# Altium project EtchaSound.PrjPcb
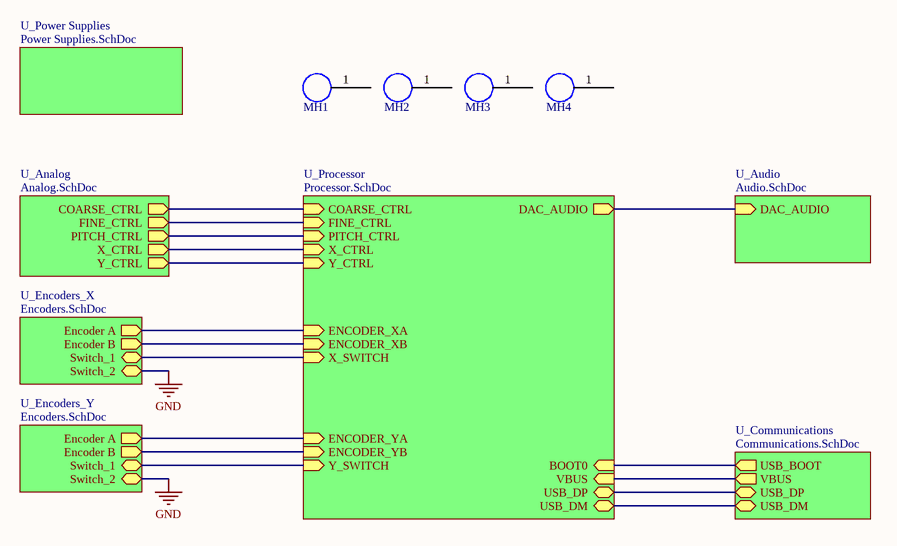
[diagram p0: Top Level.SchDoc]
7 sheets, 150 parts. Net scope: hierarchical (ports join the sheet entries above them; power ports are global).
Board file: PCB1.PcbDoc
Sheets:
  Top Level.SchDoc
    U_Encoders_X = Encoders.SchDoc
    U_Encoders_Y = Encoders.SchDoc
    U_Analog = Analog.SchDoc
    U_Communications = Communications.SchDoc
    U_Processor = Processor.SchDoc
    U_Power Supplies = Power Supplies.SchDoc
    U_Audio = Audio.SchDoc

## Sheet Top Level.SchDoc
size A

### Parts
MH1  MH  [M2_P]  (value not drawn)
MH2  MH  [M2_P]  (value not drawn)
MH3  MH  [M2_P]  (value not drawn)
MH4  MH  [M2_P]  (value not drawn)

### Sub-sheets
U_Analog = Analog.SchDoc: COARSE_CTRL (out), FINE_CTRL (out), Y_CTRL (out), X_CTRL (out), PITCH_CTRL (out)
U_Audio = Audio.SchDoc: DAC_AUDIO (in)
U_Communications = Communications.SchDoc: VBUS (out), USB_DM (bidir), USB_DP (bidir), USB_BOOT (out)
U_Encoders_X = Encoders.SchDoc: Encoder B (out), Encoder A (out), Switch_1, Switch_2
U_Encoders_Y = Encoders.SchDoc: Encoder B (out), Encoder A (out), Switch_2, Switch_1
U_Power Supplies = Power Supplies.SchDoc: no entries
U_Processor = Processor.SchDoc: Y_SWITCH (in), X_SWITCH (in), ENCODER_XA (in), ENCODER_XB (in), ENCODER_YA (in), ENCODER_YB (in), DAC_AUDIO (out), PITCH_CTRL (in), FINE_CTRL (in), COARSE_CTRL (in), X_CTRL (in), Y_CTRL (in), USB_DM (bidir), VBUS (in), USB_DP (bidir), BOOT0 (in)

### Nets
GND: sheet U_Encoders_X/Switch_2, sheet U_Encoders_Y/Switch_2
NetC5X_2: sheet U_Encoders_X/Encoder B, sheet U_Processor/ENCODER_XB
NetC5Y_2: sheet U_Encoders_Y/Encoder B, sheet U_Processor/ENCODER_YB
NetC6X_2: sheet U_Encoders_X/Encoder A, sheet U_Processor/ENCODER_XA
NetC6Y_2: sheet U_Encoders_Y/Encoder A, sheet U_Processor/ENCODER_YA
NetC40_2: sheet U_Analog/COARSE_CTRL, sheet U_Processor/COARSE_CTRL
NetC42_2: sheet U_Analog/FINE_CTRL, sheet U_Processor/FINE_CTRL
NetR3_2: sheet U_Processor/DAC_AUDIO, sheet U_Audio/DAC_AUDIO
NetR13_2: sheet U_Analog/X_CTRL, sheet U_Processor/X_CTRL
NetR14_2: sheet U_Analog/Y_CTRL, sheet U_Processor/Y_CTRL
NetR15_2: sheet U_Analog/PITCH_CTRL, sheet U_Processor/PITCH_CTRL
NetR41_2: sheet U_Communications/USB_DM, sheet U_Processor/USB_DM
NetR42_2: sheet U_Communications/USB_DP, sheet U_Processor/USB_DP
NetR44_2: sheet U_Communications/VBUS, sheet U_Processor/VBUS
NetR46_1: sheet U_Communications/USB_BOOT, sheet U_Processor/BOOT0
NetU2_EX_1: sheet U_Encoders_X/Switch_1, sheet U_Processor/X_SWITCH
NetU2_EY_1: sheet U_Encoders_Y/Switch_1, sheet U_Processor/Y_SWITCH

Not connected (* = marked no-connect by the designer): MH1 1; MH2 1; MH3 1; MH4 1

### Library data of the parts
MH1-MH4 = MH: Mounting Hole

## Sheet Encoders.SchDoc
size A
Used 2 times, as channels U_Encoders_X, U_Encoders_Y. Parts and nets are listed once, with the designators drawn on the sheet.
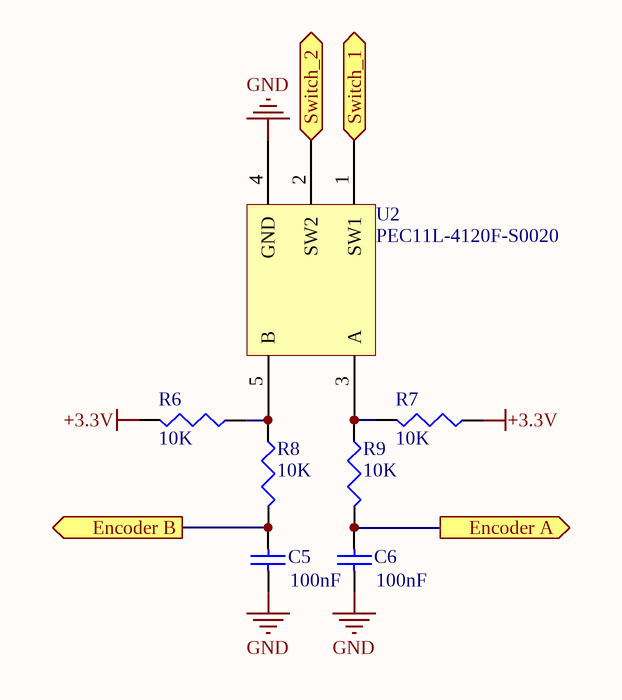
[diagram p1: Encoders.SchDoc]

### Parts
C5  value 100nF  [RES_0603]  (hidden comment: 06035G104ZAT2A)
C6  value 100nF  [RES_0603]  (hidden comment: 06035G104ZAT2A)
R6  value 10K  [RES_0805]  (hidden comment: RR1220P-103-D)
R7  value 10K  [RES_0805]  (hidden comment: RR1220P-103-D)
R8  value 10K  [RES_0805]  (hidden comment: RR1220P-103-D)
R9  value 10K  [RES_0805]  (hidden comment: RR1220P-103-D)
U2  PEC11L-4120F-S0020  [ENC5]

### Ports
Encoder A (out), Encoder B (out), Switch_1, Switch_2

### Nets
+3.3V: R6.2 R7.1
GND: C5.1 C6.1 U2.4(GND)
Encoder A: C6.2 R9.2 ; port Encoder A
Encoder B: C5.2 R8.2 ; port Encoder B
Switch_1: U2.1(SW1) ; port Switch_1
Switch_2: U2.2(SW2) ; port Switch_2
NetR6_1: R6.1 R8.1 U2.5(B)
NetR7_2: R7.2 R9.1 U2.3(A)

### Channels
U_Encoders_X: designators C5=C5X C6=C6X R6=R6X R7=R7X R8=R8X R9=R9X U2=U2_EX; ports Encoder A=NetC6X_2 Encoder B=NetC5X_2 Switch_1=NetU2_EX_1 Switch_2=GND
U_Encoders_Y: designators C5=C5Y C6=C6Y R6=R6Y R7=R7Y R8=R8Y R9=R9Y U2=U2_EY; ports Encoder A=NetC6Y_2 Encoder B=NetC5Y_2 Switch_1=NetU2_EY_1 Switch_2=GND

### Library data of the parts
C5 C6 = Cap: Capacitor; Manufacturer: AVX Corporation; Manufacturer Part Number: 06035G104ZAT2A; Supplier 1: Digi-Key; Supplier Part Number 1: 478-3724-1-ND
R6-R9 = Res3: Resistor; Manufacturer: Susumu; Manufacturer Part Number: RR1220P-103-D; Supplier 1: Digi-Key; Supplier Part Number 1: RR12P10.0KDCT-ND
U2 = PEC11-4215F-S24: Rotary Encoder with Switch; Manufacturer: Bourns Inc.; Manufacturer Part Number: PEC11L-4120F-S0020; Supplier 1: Digi-Key; Supplier Part Number 1: PEC11L-4120F-S0020-ND

## Sheet Analog.SchDoc
size B
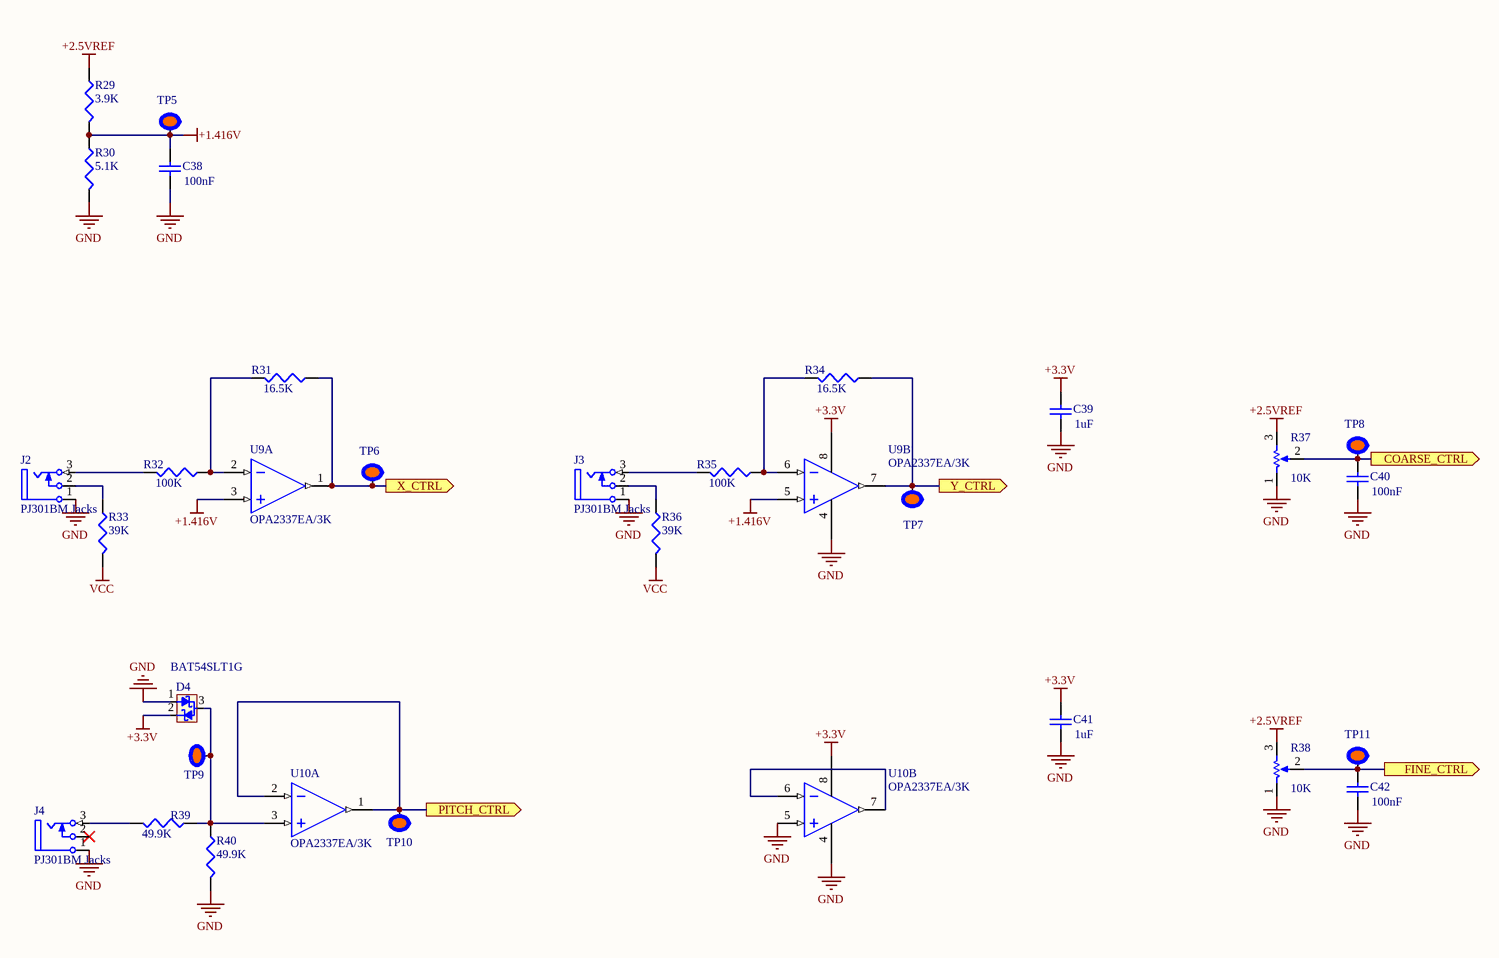
[diagram p2: Analog.SchDoc]

### Parts
C38  value 100nF  [RES_0603]  (hidden comment: 06035G104ZAT2A)
C39  value 1uF  [RES_0603]  (hidden comment: CL10A105KA8NNNC)
C40  value 100nF  [RES_0603]  (hidden comment: 06035G104ZAT2A)
C41  value 1uF  [RES_0603]  (hidden comment: CL10A105KA8NNNC)
C42  value 100nF  [RES_0603]  (hidden comment: 06035G104ZAT2A)
D4  BAT54SLT1G  [SOT23]
J2  PJ301BM Jacks  [WQP-PJ301M-12_JACK]
J3  PJ301BM Jacks  [WQP-PJ301M-12_JACK]
J4  PJ301BM Jacks  [WQP-PJ301M-12_JACK]
R29  value 3.9K  [RES_0603]  (hidden comment: ERA-3AEB392V)
R30  value 5.1K  [RES_0603]  (hidden comment: ERA-3AEB512V)
R31  value 16.5K  [RES_0603]  (hidden comment: ERA-3AEB1652V)
R32  value 100K  [RES_0603]  (hidden comment: RR0816P-104-D)
R33  value 39K  [RES_0603]  (hidden comment: ERA-3AEB393V)
R34  value 16.5K  [RES_0603]  (hidden comment: ERA-3AEB1652V)
R35  value 100K  [RES_0603]  (hidden comment: RR0816P-104-D)
R36  value 39K  [RES_0603]  (hidden comment: ERA-3AEB393V)
R37  value 10K  [P0915NEC15BR100K]  (hidden comment: P0915N-FC15BR10K)
R38  value 10K  [P0915NEC15BR100K]  (hidden comment: P0915N-FC15BR10K)
R39  value 49.9K  [RES_0603]  (hidden comment: ERA-3AEB4992V)
R40  value 49.9K  [RES_0603]  (hidden comment: ERA-3AEB4992V)
TP5  loop test point  [Test Point Mt Hole]  (value not drawn)
TP6  loop test point  [Test Point Mt Hole]  (value not drawn)
TP7  loop test point  [Test Point Mt Hole]  (value not drawn)
TP8  loop test point  [Test Point Mt Hole]  (value not drawn)
TP9  loop test point  [Test Point Mt Hole]  (value not drawn)
TP10  loop test point  [Test Point Mt Hole]  (value not drawn)
TP11  loop test point  [Test Point Mt Hole]  (value not drawn)
U9  OPA2337EA/3K  [SOT-23-8]  (parts A,B of 2)
U10  OPA2337EA/3K  [SOT-23-8]  (parts A,B of 2)

### Ports
COARSE_CTRL (out), FINE_CTRL (out), PITCH_CTRL (out), X_CTRL (out), Y_CTRL (out)

### Nets
+1.416V: C38.2 R29.2 R30.1 TP5.1 U9.3(IN_A+) U9.5(IN_B+)
+2.5VREF: R29.1 R37.3 R38.3
+3.3V: C39.2 C41.2 D4.2 U9.8 U10.8
GND: C38.1 C39.1 C40.1 C41.1 C42.1 D4.1 J2.1(S) J3.1(S) J4.1(S) R30.2 R37.1 R38.1 R40.2 U9.4 U10.4 U10.5(IN_B+)
VCC: R33.2 R36.2
NetC40_2: C40.2 R37.2 TP8.1 ; port COARSE_CTRL
NetC42_2: C42.2 R38.2 TP11.1 ; port FINE_CTRL
NetD4_3: D4.3 R39.1 R40.1 TP9.1 U10.3(IN_A+)
NetJ2_2: J2.2(TN) R33.1
NetJ2_3: J2.3(T) R32.2
NetJ3_2: J3.2(TN) R36.1
NetJ3_3: J3.3(T) R35.2
NetJ4_3: J4.3(T) R39.2
NetR13_2: R31.1 TP6.1 U9.1(OUT_A) ; port X_CTRL
NetR14_2: R34.1 TP7.1 U9.7(OUT_B) ; port Y_CTRL
NetR15_2: TP10.1 U10.1(OUT_A) U10.2(IN_A-) ; port PITCH_CTRL
NetR31_2: R31.2 R32.1 U9.2(IN_A-)
NetR34_2: R34.2 R35.1 U9.6(IN_B-)
NetU10_6: U10.6(IN_B-) U10.7(OUT_B)

Not connected (* = marked no-connect by the designer): J4 2(TN)*

### Library data of the parts
C38 C40 C42 = Cap: Capacitor; Manufacturer: AVX Corporation; Manufacturer Part Number: 06035G104ZAT2A; Supplier 1: Digi-Key; Supplier Part Number 1: 478-3724-1-ND
C39 C41 = Cap: Capacitor; Manufacturer: Samsung Electro-Mechanics; Manufacturer Part Number: CL10A105KA8NNNC; Supplier 1: Digi-Key; Supplier Part Number 1: 1276-1102-1-ND
D4 = SCHOTTKY DIODE ARRAY: DIODE ARRAY SCHOTTKY; Manufacturer: ON Semiconductor; Supplier 1: Digi-Key; Supplier Part Number 1: BAT54SLT1GOSCT-ND; Manufacturer Part Number: BAT54SLT1G
J2-J4 = Phonejack2 TN: Jack Socket, 1/4" [6.5mm], Thru-Hole, Vertical, 2-Conductor with Tip closed; Manufacturer: Thonkiconn; Manufacturer Part Number: PJ301BM Jacks
R29-R31 R34 R39 R40 = Res3: Resistor; Manufacturer: Panasonic; Supplier 1: Digi-Key
  R29: Manufacturer Part Number: ERA-3AEB392V; Supplier Part Number 1: P3.9KDBCT-ND
  R30: Manufacturer Part Number: ERA-3AEB512V; Supplier Part Number 1: P5.1KDBCT-ND
  R31 R34: Manufacturer Part Number: ERA-3AEB1652V; Supplier Part Number 1: P16.5KDBCT-ND
  R39 R40: Manufacturer Part Number: ERA-3AEB4992V; Supplier Part Number 1: P49.9KDBTR-ND
R32 R35 = Res3: Resistor; Manufacturer: Susumu; Manufacturer Part Number: RR0816P-104-D; Supplier 1: Digi-Key; Supplier Part Number 1: RR08P100KDCT-ND
R33 R36 = Res3: Manufacturer: Panasonic Electronic Components; Manufacturer Part Number: ERA-3AEB393V; Supplier 1: Digi-Key; Supplier Part Number 1: P39KDBCT-ND
R37 R38 = RPot: Potentiometer; Manufacturer: TT Electronics/BI; Manufacturer Part Number: P0915N-FC15BR10K; Supplier 1: Digi-Key; Supplier 1 Part Number: 987-1649-ND
TP5-TP11 = 402046: Test Point Loop Miniature Keysone; Manufacturer: Keystone Electronics; Manufacturer Part Number: 5003; Supplier 1: Digi-Key; Supplier Part Number 1: 36-5003-ND
U9 U10 = OPA2137E/2K5: Low Cost FET-Input Operational Amplifier, 4.5 to 36 V, -40 to 85 degC, 8-pin SOP (DGK8), Green (RoHS & no Sb/Br); Manufacturer: Texas Instruments; Manufacturer Part Number: OPA2337EA/3K; Supplier 1: Digi-Key; Supplier Part Number 1: 296-26252-1-ND

## Sheet Communications.SchDoc
size A
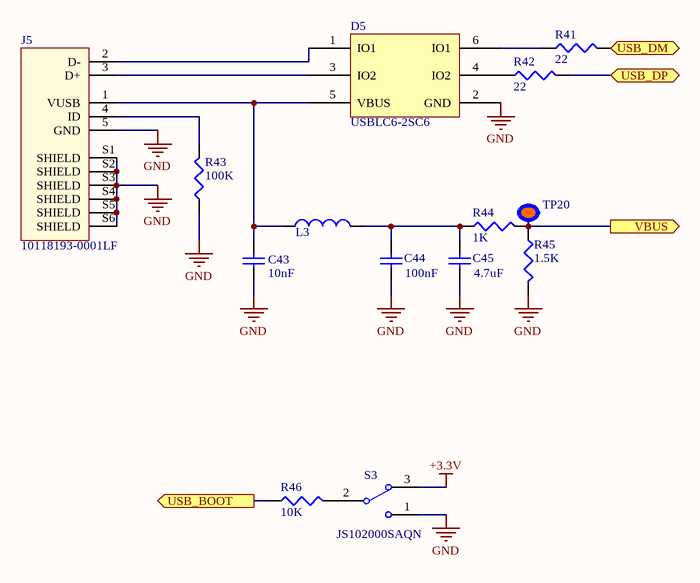
[diagram p3: Communications.SchDoc]

### Parts
C43  value 10nF  [RES_0603]  (hidden comment: CL10B103KB8NCNC)
C44  value 100nF  [RES_0603]  (hidden comment: 06035G104ZAT2A)
C45  value 4.7uF  [RES_0805]  (hidden comment: CL21A475KACLRNC)
D5  USBLC6-2SC6  [SOT23-6L]
J5  10118193-0001LF  [10118193-0001LF]
L3  BLM18PG221SZ1D  [RES_0603]  (value not drawn)
R41  value 22  [RES_0603]  (hidden comment: CRGCQ0603J22R)
R42  value 22  [RES_0603]  (hidden comment: CRGCQ0603J22R)
R43  value 100K  [RES_0603]  (hidden comment: RR0816P-104-D)
R44  value 1K  [RES_0603]  (hidden comment: RR0816P-102-D)
R45  value 1.5K  [RES_0603]  (hidden comment: A121524CT-ND)
R46  value 10K  [RES_0805]  (hidden comment: RR1220P-103-D)
S3  JS102000SAQN  [JS102011SAQN]
TP20  loop test point  [Test Point Mt Hole]  (value not drawn)

### Ports
USB_BOOT (out), USB_DM (bidir), USB_DP (bidir), VBUS (out)

### Nets
+3.3V: S3.3
GND: C43.1 C44.1 C45.1 D5.2(GND) J5.5(GND) J5.S1(SHIELD) J5.S2(SHIELD) J5.S3(SHIELD) J5.S4(SHIELD) J5.S5(SHIELD) J5.S6(SHIELD) R43.1 R45.2 S3.1
NetC43_2: C43.2 D5.5(VBUS) J5.1(VUSB) L3.1
NetC44_2: C44.2 C45.2 L3.2 R44.1
NetD5_1: D5.1(IO1) J5.2(D-)
NetD5_3: D5.3(IO2) J5.3(D+)
NetD5_4: D5.4(IO2) R42.1
NetD5_6: D5.6(IO1) R41.1
NetJ5_4: J5.4(ID) R43.2
NetR41_2: R41.2 ; port USB_DM
NetR42_2: R42.2 ; port USB_DP
NetR44_2: R44.2 R45.1 TP20.1 ; port VBUS
NetR46_1: R46.1 ; port USB_BOOT
NetR46_2: R46.2 S3.2

### Library data of the parts
C43 C45 = Cap: as C39 on sheet Analog; Supplier 1: Digi-Key
  C43: Manufacturer Part Number: CL10B103KB8NCNC; Supplier Part Number 1: 1276-1921-1-ND
  C45: Manufacturer Part Number: CL21A475KACLRNC; Supplier Part Number 1: 1276-2415-1-ND
C44 = Cap: Capacitor; Manufacturer: AVX Corporation; Manufacturer Part Number: 06035G104ZAT2A; Supplier 1: Digi-Key; Supplier Part Number 1: 478-3724-1-ND
D5 = USBLC6-2SC6: TVS DIODE 5.25V 17V SOT23-6; Manufacturer: STMicroelectronics; Supplier 1: Digi-Key; Supplier Part Number 1: 497-5235-1-ND; Manufacturer Part Number: USBLC6-2SC6
J5 = 10118193-0001LF: Single Port 5 Contact Shielded SMT MICRO USB B-Type Receptacle; Manufacturer: Amphenol ICC; Supplier 1: Digi-Key; Manufacturer Part Number: 10118193-0001LF; Supplier Part Number 1: 609-4616-1-ND
L3 = Inductor: Manufacturer: Murata Electronics; Value: 220 OHM; Manufacturer Part Number: BLM18PG221SZ1D; Supplier 1: Digi-Key; Supplier Part Number 1: 490-16588-1-ND
R41 R42 = Res3: Manufacturer: TE Connectivity Passive Product; Manufacturer Part Number: CRGCQ0603J22R; Supplier 1: Digi-Key; Supplier Part Number 1: A130081CT-ND
R43 R44 R46 = Res3: Resistor; Manufacturer: Susumu; Supplier 1: Digi-Key
  R43: Manufacturer Part Number: RR0816P-104-D; Supplier Part Number 1: RR08P100KDCT-ND
  R44: Manufacturer Part Number: RR0816P-102-D; Supplier Part Number 1: RR08P1.0KDDKR-ND
  R46: Manufacturer Part Number: RR1220P-103-D; Supplier Part Number 1: RR12P10.0KDCT-ND
R45 = Res3: Resistor; Manufacturer: TE Connectivity Passive Product; Manufacturer Part Number: A121524CT-ND; Supplier 1: Digi-Key; Supplier Part Number 1: CRG0603F1K5
S3 = SW-SPDT: SWITCH SLIDE SPDT 1MA 5V; Manufacturer: C&K; Supplier 1: Digi-Key; Supplier Part Number 1: 401-1999-1-ND; Manufacturer Part Number: JS102011SAQN
TP20 = 402046: as TP5 on sheet Analog; Supplier 1: Digi-Key; Supplier Part Number 1: 36-5003-ND

## Sheet Processor.SchDoc
size B
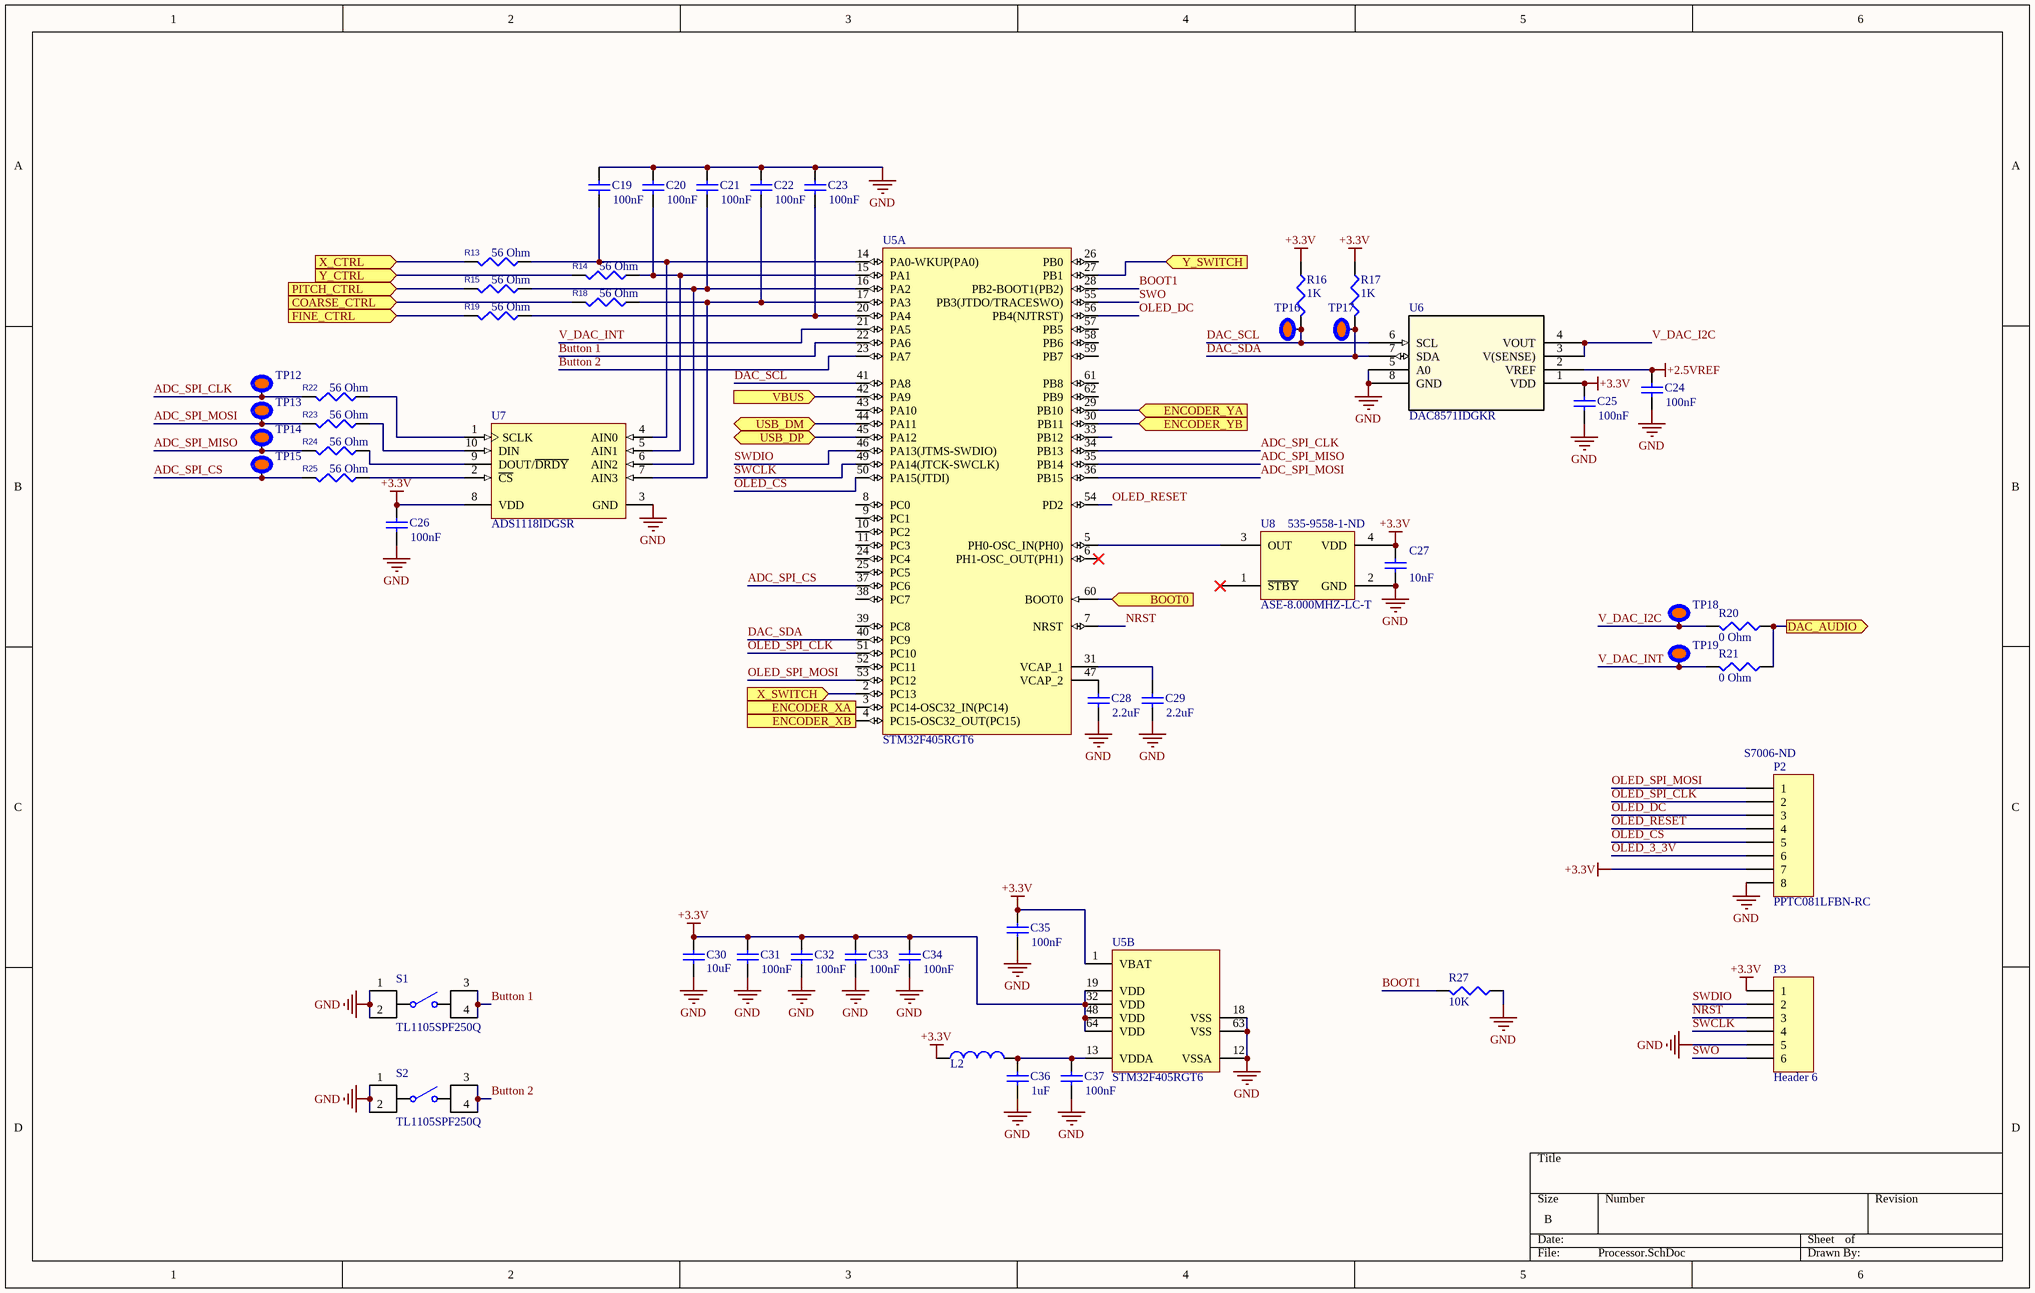
[diagram p4: Processor.SchDoc]

### Parts
C19  value 100nF  [RES_0603]  (hidden comment: 06035G104ZAT2A)
C20  value 100nF  [RES_0603]  (hidden comment: 06035G104ZAT2A)
C21  value 100nF  [RES_0603]  (hidden comment: 06035G104ZAT2A)
C22  value 100nF  [RES_0603]  (hidden comment: 06035G104ZAT2A)
C23  value 100nF  [RES_0603]  (hidden comment: 06035G104ZAT2A)
C24  value 100nF  [RES_0603]  (hidden comment: 06035G104ZAT2A)
C25  value 100nF  [RES_0603]  (hidden comment: 06035G104ZAT2A)
C26  value 100nF  [RES_0603]  (hidden comment: 06035G104ZAT2A)
C27  value 10nF  [RES_0603]  (hidden comment: CL10B103KB8NCNC)
C28  value 2.2uF  [RES_0805]  (hidden comment: C2012JB1E225M125AC)
C29  value 2.2uF  [RES_0805]  (hidden comment: C2012JB1E225M125AC)
C30  value 10uF  [RES_1206]  (hidden comment: GRT31CR61H106ME01L)
C31  value 100nF  [RES_0603]  (hidden comment: 06035G104ZAT2A)
C32  value 100nF  [RES_0603]  (hidden comment: 06035G104ZAT2A)
C33  value 100nF  [RES_0603]  (hidden comment: 06035G104ZAT2A)
C34  value 100nF  [RES_0603]  (hidden comment: 06035G104ZAT2A)
C35  value 100nF  [RES_0603]  (hidden comment: 06035G104ZAT2A)
C36  value 1uF  [RES_0603]  (hidden comment: CL10A105KA8NNNC)
C37  value 100nF  [RES_0603]  (hidden comment: 06035G104ZAT2A)
L2  742792651  [RES_0603]  (value not drawn)
P2  PPTC081LFBN-RC  Supplier Part Number 1: S7006-ND  [HDR1X8]
P3  Header 6  [TC2030-MCP]
R13  value 56 Ohm  [RES_0603]  (hidden comment: CRGP0603F56R)
R14  value 56 Ohm  [RES_0603]  (hidden comment: CRGP0603F56R)
R15  value 56 Ohm  [RES_0603]  (hidden comment: CRGP0603F56R)
R16  value 1K  [RES_0603]  (hidden comment: RR0816P-102-D)
R17  value 1K  [RES_0603]  (hidden comment: RR0816P-102-D)
R18  value 56 Ohm  [RES_0603]  (hidden comment: CRGP0603F56R)
R19  value 56 Ohm  [RES_0603]  (hidden comment: CRGP0603F56R)
R20  value 0 Ohm  [RES_0603]  (hidden comment: RC0603JR-070RL)
R21  value 0 Ohm  [RES_0603]  (hidden comment: RC0603JR-070RL)
R22  value 56 Ohm  [RES_0603]  (hidden comment: CRGP0603F56R)
R23  value 56 Ohm  [RES_0603]  (hidden comment: CRGP0603F56R)
R24  value 56 Ohm  [RES_0603]  (hidden comment: CRGP0603F56R)
R25  value 56 Ohm  [RES_0603]  (hidden comment: CRGP0603F56R)
R27  value 10K  [RES_0805]  (hidden comment: RR1220P-103-D)
S1  TL1105SPF250Q  [E_SWITCH]
S2  TL1105SPF250Q  [E_SWITCH]
TP12  loop test point  [Test Point Mt Hole]  (value not drawn)
TP13  loop test point  [Test Point Mt Hole]  (value not drawn)
TP14  loop test point  [Test Point Mt Hole]  (value not drawn)
TP15  loop test point  [Test Point Mt Hole]  (value not drawn)
TP16  loop test point  [Test Point Mt Hole]  (value not drawn)
TP17  loop test point  [Test Point Mt Hole]  (value not drawn)
TP18  loop test point  [Test Point Mt Hole]  (value not drawn)
TP19  loop test point  [Test Point Mt Hole]  (value not drawn)
U5  STM32F405RGT6  [STM-LQFP64_N]  (parts A,B of 2)
U6  DAC8571IDGKR  [DGK8]
U7  ADS1118IDGSR  [TI-DGS10_N]
U8  ASE-8.000MHZ-LC-T  Supplier Part Number 1: 535-9558-1-ND  [ASE-8.000MHZ-LC-T]

### Ports
BOOT0 (in), COARSE_CTRL (in), DAC_AUDIO (out), ENCODER_XA (in), ENCODER_XB (in), ENCODER_YA (in), ENCODER_YB (in), FINE_CTRL (in), PITCH_CTRL (in), USB_DM (bidir), USB_DP (bidir), VBUS (in), X_CTRL (in), X_SWITCH (in), Y_CTRL (in), Y_SWITCH (in)

### Nets
+2.5VREF: C24.2 U6.2(VREF)
+3.3V: C25.2 C26.2 C27.2 C30.1 C31.2 C32.2 C33.2 C34.2 C35.2 L2.1 P2.7 P3.1 R16.1 R17.1 U5.1(VBAT) U5.19(VDD) U5.32(VDD) U5.48(VDD) U5.64(VDD) U6.1(VDD) U7.8(VDD) U8.4(VDD)
GND: C19.2 C20.2 C21.2 C22.2 C23.2 C24.1 C25.1 C26.1 C27.1 C28.1 C29.1 C30.2 C31.1 C32.1 C33.1 C34.1 C35.1 C36.1 C37.1 P2.8 P3.5 R27.1 S1.1(COMMON) S1.2(COMMON) S2.1(COMMON) S2.2(COMMON) U5.12(VSSA) U5.18(VSS) U5.63(VSS) U6.5(A0) U6.8(GND) U7.3(GND) U8.2(GND)
ADC_SPI_CLK: R22.2 TP12.1 U5.34(PB13)
ADC_SPI_CS: R25.2 TP15.1 U5.37(PC6)
ADC_SPI_MISO: R24.2 TP14.1 U5.35(PB14)
ADC_SPI_MOSI: R23.2 TP13.1 U5.36(PB15)
BOOT1: R27.2 U5.28(PB2-BOOT1(PB2))
Button 1: S1.3(NO) S1.4(NO) U5.22(PA6)
Button 2: S2.3(NO) S2.4(NO) U5.23(PA7)
DAC_SCL: R16.2 TP16.1 U5.41(PA8) U6.6(SCL)
DAC_SDA: R17.2 TP17.1 U5.40(PC9) U6.7(SDA)
NRST: P3.3 U5.7(NRST)
OLED_3_3V: P2.6
OLED_CS: P2.5 U5.50(PA15(JTDI))
OLED_DC: P2.3 U5.56(PB4(NJTRST))
OLED_RESET: P2.4 U5.54(PD2)
OLED_SPI_CLK: P2.2 U5.51(PC10)
OLED_SPI_MOSI: P2.1 U5.53(PC12)
SWCLK: P3.4 U5.49(PA14(JTCK-SWCLK))
SWDIO: P3.2 U5.46(PA13(JTMS-SWDIO))
SWO: P3.6 U5.55(PB3(JTDO/TRACESWO))
V_DAC_I2C: R20.2 TP18.1 U6.3(V(SENSE)) U6.4(VOUT)
V_DAC_INT: R21.2 TP19.1 U5.21(PA5)
NetC5X_2: U5.4(PC15-OSC32_OUT(PC15)) ; port ENCODER_XB
NetC5Y_2: U5.30(PB11) ; port ENCODER_YB
NetC6X_2: U5.3(PC14-OSC32_IN(PC14)) ; port ENCODER_XA
NetC6Y_2: U5.29(PB10) ; port ENCODER_YA
NetC19_1: C19.1 R13.1 U5.14(PA0-WKUP(PA0)) U7.4(AIN0)
NetC20_1: C20.1 R14.1 U5.15(PA1) U7.5(AIN1)
NetC21_1: C21.1 R15.1 U5.16(PA2) U7.6(AIN2)
NetC22_1: C22.1 R18.1 U5.17(PA3) U7.7(AIN3)
NetC23_1: C23.1 R19.1 U5.20(PA4)
NetC28_2: C28.2 U5.47(VCAP_2)
NetC29_2: C29.2 U5.31(VCAP_1)
NetC36_2: C36.2 C37.2 L2.2 U5.13(VDDA)
NetC40_2: R18.2 ; port COARSE_CTRL
NetC42_2: R19.2 ; port FINE_CTRL
NetR3_2: R20.1 R21.1 ; port DAC_AUDIO
NetR13_2: R13.2 ; port X_CTRL
NetR14_2: R14.2 ; port Y_CTRL
NetR15_2: R15.2 ; port PITCH_CTRL
NetR22_1: R22.1 U7.1(SCLK)
NetR23_1: R23.1 U7.10(DIN)
NetR24_1: R24.1 U7.9(DOUT/~{DRDY})
NetR25_1: R25.1 U7.2(~{CS})
NetR41_2: U5.44(PA11) ; port USB_DM
NetR42_2: U5.45(PA12) ; port USB_DP
NetR44_2: U5.42(PA9) ; port VBUS
NetR46_1: U5.60(BOOT0) ; port BOOT0
NetU2_EX_1: U5.2(PC13) ; port X_SWITCH
NetU2_EY_1: U5.27(PB1) ; port Y_SWITCH
NetU5_5: U5.5(PH0-OSC_IN(PH0)) U8.3(OUT)

Not connected (* = marked no-connect by the designer): U5 6(PH1-OSC_OUT(PH1))* 8(PC0) 9(PC1) 10(PC2) 11(PC3) 24(PC4) 25(PC5) 26(PB0) 33(PB12) 38(PC7) 39(PC8) 43(PA10) 52(PC11) 57(PB5) 58(PB6) 59(PB7) 61(PB8) 62(PB9); U8 1(~{STBY})*

### Library data of the parts
C19-C26 C31-C35 C37 = Cap: Capacitor; Manufacturer: AVX Corporation; Manufacturer Part Number: 06035G104ZAT2A; Supplier 1: Digi-Key; Supplier Part Number 1: 478-3724-1-ND
C27 C36 = Cap: as C39 on sheet Analog; Supplier 1: Digi-Key
  C27: Manufacturer Part Number: CL10B103KB8NCNC; Supplier Part Number 1: 1276-1921-1-ND
  C36: Manufacturer Part Number: CL10A105KA8NNNC; Supplier Part Number 1: 1276-1102-1-ND
C28 C29 = Cap: Capacitor; Manufacturer: TDK; Manufacturer Part Number: C2012JB1E225M125AC; Supplier 1: Mouser; Supplier Part Number 1: 810-C2012JB1E225M12C
C30 = Cap: Capacitor; Manufacturer: Murata; Supplier 1: Digi-Key; Supplier Part Number 1: 490-12457-1-ND; Manufacturer Part Number: GRT31CR61H106ME01L
L2 = Inductor: Manufacturer: Wurth Electronics Inc.; Value: 600 OHM; Manufacturer Part Number: 742792651; Supplier 1: Digi-Key; Supplier Part Number 1: 732-1593-2-ND
P2 = MHDR1X8: Header, 8-Pin; Manufacturer: Sullins Connector Solutions; Supplier 1: Digi-Key; Manufacturer Part Number: PPTC081LFBN-RC
P3 = Header 6: Header, 6-Pin; LatestRevisionDate: 17-Jul-2002; LatestRevisionNote: Re-released for DXP Platform.; Publisher: Altium Limited
R13-R15 R18 R19 R22-R25 = R_Dup1: Resistor; Manufacturer: TE Connectivity Passive Product; Manufacturer Part Number: CRGP0603F56R; Supplier 1: Digi-Key; Supplier Part Number 1: A130401CT-ND
R16 R17 R27 = Res3: Resistor; Manufacturer: Susumu; Supplier 1: Digi-Key
  R16 R17: Manufacturer Part Number: RR0816P-102-D; Supplier Part Number 1: RR08P1.0KDDKR-ND
  R27: Manufacturer Part Number: RR1220P-103-D; Supplier Part Number 1: RR12P10.0KDCT-ND
R20 R21 = Res3: Resistor; Manufacturer: Yageo; Manufacturer Part Number: RC0603JR-070RL; Supplier 1: Digi-Key; Supplier Part Number 1: 311-0.0GRCT-ND
S1 S2 = SPST E SWITCH: SWITCH TACTILE SPST; Manufacturer: E-Switch; Supplier 1: Digi-Key; Supplier Part Number 1: EG1862-ND; Manufacturer Part Number: TL1105SPF250Q
TP12-TP19 = 402046: as TP5 on sheet Analog; Supplier 1: Digi-Key; Supplier Part Number 1: 36-5003-ND
U5 = STM32F405RGT6: ARM Cortex-M4 32-bit MCU+FPU, 210 DMIPS, 1024 kB Flash, 192 kB Internal RAM, 51 I/Os, 64-pin LQFP, -40 to 85 degC, Tray; Manufacturer: STMicroelectronics; Supplier 1: Digi-Key; Supplier Part Number 1: 497-11767-ND; Manufacturer Part Number: STM32F405RGT6
U6 = DAC8571IDGKR: Manufacturer: Texas Instruments; Manufacturer Part Number: DAC8571IDGKR; Supplier 1: Digi-Key; Supplier Part Number 1: 296-14307-1-ND
U7 = ADS1118IDGSR: 16-Bit ADC with Integrated Multiplexer, PGA, Temperature Sensor, Oscillator, and Reference, -40 to 125 degC, 10-pin SOP (DGS10), Green (RoHS & no Sb/Br); Manufacturer: Texas Instruments; Manufacturer Part Number: ADS1118IDGSR; Supplier 1: Digi-Key; Supplier Part Number 1: 296-38850-1-ND
U8 = ASE-8.000MHZ-LC-T: XTAL OSC XO 8.0000MHZ CMOS SMD; Manufacturer: Abracon LLC; Manufacturer Part Number: ASE-8.000MHZ-LC-T; Supplier 1: Digi-Key

## Sheet Power Supplies.SchDoc
size A
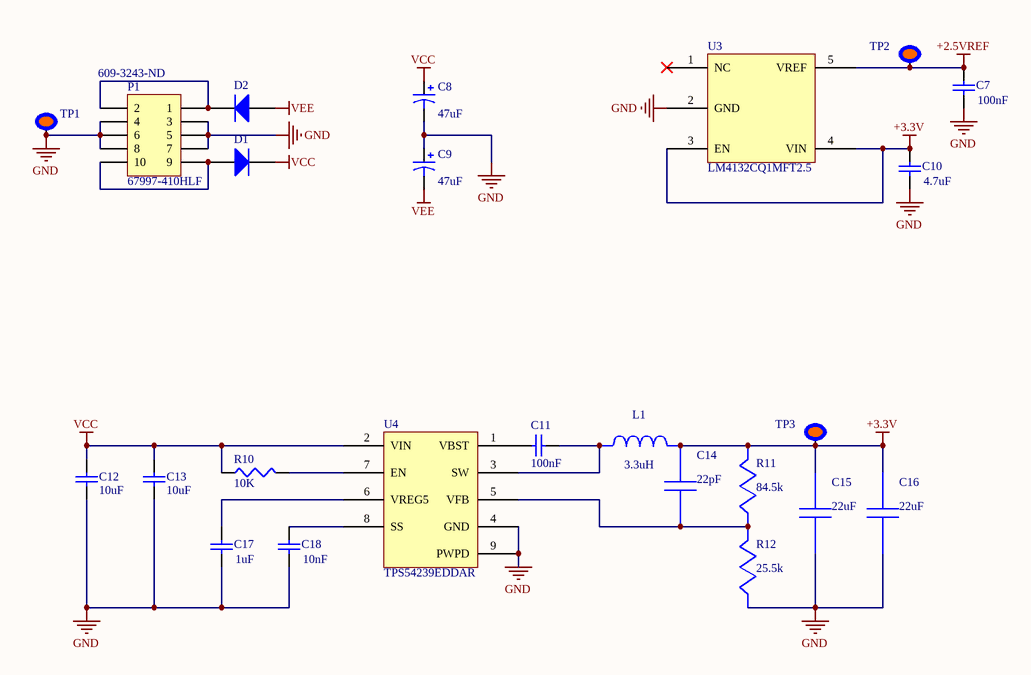
[diagram p5: Power Supplies.SchDoc]

### Parts
C7  value 100nF  [RES_0603]  (hidden comment: 06035G104ZAT2A)
C8  value 47uF  [CAPAE_UW_J_6.3mm]  (hidden comment: EEE-FK1V470P)
C9  value 47uF  [CAPAE_UW_J_6.3mm]  (hidden comment: EEE-FK1V470P)
C10  value 4.7uF  [RES_0805]  (hidden comment: CL21A475KACLRNC)
C11  value 100nF  [RES_0603]  (hidden comment: 06035G104ZAT2A)
C12  value 10uF  [RES_1206]  (hidden comment: GRT31CR61H106ME01L)
C13  value 10uF  [RES_1206]  (hidden comment: GRT31CR61H106ME01L)
C14  value 22pF  [RES_0603]  (hidden comment: C0603C220J5GACTU)
C15  value 22uF  [RES_0805]  (hidden comment: CL21A226KPCLRNC)
C16  value 22uF  [RES_0805]  (hidden comment: CL21A226KPCLRNC)
C17  value 1uF  [RES_0603]  (hidden comment: CL10A105KA8NNNC)
C18  value 10nF  [RES_0603]  (hidden comment: CL10B103KB8NCNC)
D1  1N5819HW-7-F  [SOD123]  (value not drawn)
D2  1N5819HW-7-F  [SOD123]  (value not drawn)
L1  value 3.3uH  [INDPM6060X450N]  (hidden comment: VLS6045EX-3R3N)
P1  67997-410HLF  Supplier Part Number 1: 609-3243-ND  [HDR2X5]
R10  value 10K  [RES_0805]  (hidden comment: RR1220P-103-D)
R11  value 84.5k  [RES_0603]  (hidden comment: ERA-3AEB8452V)
R12  value 25.5k  [RES_0603]  (hidden comment: ERA-3AEB2552V)
TP1  loop test point  [Test Point Mt Hole]  (value not drawn)
TP2  loop test point  [Test Point Mt Hole]  (value not drawn)
TP3  loop test point  [Test Point Mt Hole]  (value not drawn)
U3  LM4132CQ1MFT2.5  [LM4132CQ1MFT2.5]
U4  TPS54239EDDAR  [DDA]

### Nets
+2.5VREF: C7.2 TP2.1 U3.5(VREF)
+3.3V: C10.2 C14.1 C15.1 C16.1 L1.1 R11.1 TP3.1 U3.3(EN) U3.4(VIN)
GND: C7.1 C8.2 C9.1 C10.1 C12.2 C13.2 C15.2 C16.2 C17.1 C18.1 P1.3 P1.4 P1.5 P1.6 P1.7 P1.8 R12.2 TP1.1 U3.2(GND) U4.4(GND) U4.9(PWPD)
VCC: C8.1 C12.1 C13.1 D1.2(K) R10.1 U4.2(VIN)
VEE: C9.2 D2.1(A)
NetC11_1: C11.1 L1.2 U4.3(SW)
NetC11_2: C11.2 U4.1(VBST)
NetC14_2: C14.2 R11.2 R12.1 U4.5(VFB)
NetC17_2: C17.2 U4.6(VREG5)
NetC18_2: C18.2 U4.8(SS)
NetD1_1: D1.1(A) P1.9 P1.10
NetD2_2: D2.2(K) P1.1 P1.2
NetR10_2: R10.2 U4.7(EN)

Not connected (* = marked no-connect by the designer): U3 1(NC)*

### Library data of the parts
C7 C11 = Cap: Capacitor; Manufacturer: AVX Corporation; Manufacturer Part Number: 06035G104ZAT2A; Supplier 1: Digi-Key; Supplier Part Number 1: 478-3724-1-ND
C8 C9 = Cap Pol3: Polarized Capacitor (Surface Mount); Manufacturer: Panasonic; Manufacturer Part Number: EEE-FK1V470P; Supplier 1: Digi-Key; Supplier Part Number 1: PCE3842CT-ND
C10 C17 C18 = Cap: as C39 on sheet Analog; Supplier 1: Digi-Key
  C10: Manufacturer Part Number: CL21A475KACLRNC; Supplier Part Number 1: 1276-2415-1-ND
  C17: Manufacturer Part Number: CL10A105KA8NNNC; Supplier Part Number 1: 1276-1102-1-ND
  C18: Manufacturer Part Number: CL10B103KB8NCNC; Supplier Part Number 1: 1276-1921-1-ND
C12 C13 = Cap: Capacitor; Manufacturer: Murata; Supplier 1: Digi-Key; Supplier Part Number 1: 490-12457-1-ND; Manufacturer Part Number: GRT31CR61H106ME01L
C14 = GJM0335C0J220JB01D: Capacitor; Manufacturer: KEMET; Manufacturer Part Number: C0603C220J5GACTU; Supplier 1: Digi-Key; Supplier Part Number 1: 399-1053-1-ND
C15 C16 = C2012X5R1V226M125AC: Capacitor; Manufacturer: Samsung Electro-Mechanics; Manufacturer Part Number: CL21A226KPCLRNC; Supplier 1: Digi-Key; Supplier Part Number 1: 1276-6786-1-ND
D1 D2 = Diode: Default Diode; Manufacturer: Diodes Incorporated; Manufacturer Part Number: 1N5819HW-7-F; Supplier 1: Digi-Key; Supplier Part Number 1: 1N5819HW-FDICT-ND
L1 = CLF7045T-3R3N: Inductor; Manufacturer: TDK; Manufacturer Part Number: VLS6045EX-3R3N; Supplier 1: Mouser; Supplier Part Number 1: 810-VLS6045EX-3R3N
P1 = Header 5X2: Header, 5-Pin, Dual row; Manufacturer: Amphenol FCI; Manufacturer Part Number: 67997-410HLF; Supplier 1: Digi-Key
R10 = Res3: Resistor; Manufacturer: Susumu; Manufacturer Part Number: RR1220P-103-D; Supplier 1: Digi-Key; Supplier Part Number 1: RR12P10.0KDCT-ND
R11 = CRCW040284K5FKED: Resistor; Manufacturer: Panasonic Electronic Components; Manufacturer Part Number: ERA-3AEB8452V; Supplier 1: Digi-Key; Supplier Part Number 1: P84.5KDBCT-ND
R12 = CRCW040225K5FKED: Resistor; Manufacturer: Panasonic Electronic Components; Manufacturer Part Number: ERA-3AEB2552V; Supplier 1: Digi-Key; Supplier Part Number 1: P25.5KDBCT-ND
TP1-TP3 = 402046: as TP5 on sheet Analog; Supplier 1: Digi-Key; Supplier Part Number 1: 36-5003-ND
U3 = LM4132: Precision Low Dropout 2.5V Reference; Manufacturer: Texas Instruments; Supplier 1 Part Number: 296-48574-1-ND; Supplier 1: Digi-Key; Manufacturer Part Number: LM4132CQ1MFT2.5
U4 = TPS54239EDDA: 4.5V to 23V Input, 2-A Synchronous Step-Down SWIFT™ Converter With Eco-mode; Manufacturer: Texas Instruments; Manufacturer Part Number: TPS54239EDDAR; Supplier 1: Digi-Key; Supplier Part Number 1: 296-35690-1-ND

## Sheet Audio.SchDoc
size A
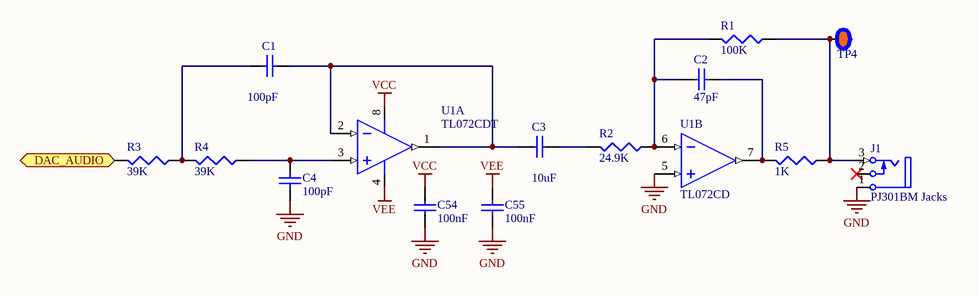
[diagram p6: Audio.SchDoc]

### Parts
C1  value 100pF  [RES_0603]  (hidden comment: CC0603JRNPO9BN101)
C2  value 47pF  [RES_0603]  (hidden comment: 06031A470FAT2A)
C3  value 10uF  [RES_1206]  (hidden comment: GRT31CR61H106ME01L)
C4  value 100pF  [RES_0603]  (hidden comment: CC0603JRNPO9BN101)
C54  value 100nF  [RES_0603]  (hidden comment: 06035G104ZAT2A)
C55  value 100nF  [RES_0603]  (hidden comment: 06035G104ZAT2A)
J1  PJ301BM Jacks  [WQP-PJ301M-12_JACK]
R1  value 100K  [RES_0603]  (hidden comment: RR0816P-104-D)
R2  value 24.9K  [RES_0603]  (hidden comment: ERA-3AEB2492V)
R3  value 39K  [RES_0603]  (hidden comment: ERA-3AEB393V)
R4  value 39K  [RES_0603]  (hidden comment: ERA-3AEB393V)
R5  value 1K  [RES_0603]  (hidden comment: RR0816P-102-D)
TP4  loop test point  [Test Point Mt Hole]  (value not drawn)
U1  TL072CDT  [TI-D8_N]  (parts A,B of 2)

### Ports
DAC_AUDIO (in)

### Nets
GND: C4.1 C54.1 C55.1 J1.1(S) U1.5(IN2+)
VCC: C54.2 U1.8(V+)
VEE: C55.2 U1.4(V-)
NetC1_1: C1.1 R3.1 R4.2
NetC1_2: C1.2 C3.1 U1.1(OUT1) U1.2(IN1-)
NetC2_1: C2.1 R5.2 U1.7(OUT2)
NetC2_2: C2.2 R1.2 R2.1 U1.6(IN2-)
NetC3_2: C3.2 R2.2
NetC4_2: C4.2 R4.1 U1.3(IN1+)
NetJ1_3: J1.3(T) R1.1 R5.1 TP4.1
NetR3_2: R3.2 ; port DAC_AUDIO

Not connected (* = marked no-connect by the designer): J1 2(TN)*

### Library data of the parts
C1 C4 = Cap: Capacitor; Manufacturer: Yageo; Manufacturer Part Number: CC0603JRNPO9BN101; Supplier 1: Digi-Key; Supplier Part Number 1: 311-1069-1-ND
C2 C54 C55 = Cap: Capacitor; Manufacturer: AVX Corporation; Supplier 1: Digi-Key
  C2: Manufacturer Part Number: 06031A470FAT2A; Supplier Part Number 1: 478-3691-1-ND
  C54 C55: Manufacturer Part Number: 06035G104ZAT2A; Supplier Part Number 1: 478-3724-1-ND
C3 = Cap: Capacitor; Manufacturer: Murata; Supplier 1: Digi-Key; Supplier Part Number 1: 490-12457-1-ND; Manufacturer Part Number: GRT31CR61H106ME01L
J1 = Phonejack2 TN: as J2 on sheet Analog; Manufacturer Part Number: PJ301BM Jacks
R1 R5 = Res3: Resistor; Manufacturer: Susumu; Supplier 1: Digi-Key
  R1: Manufacturer Part Number: RR0816P-104-D; Supplier Part Number 1: RR08P100KDCT-ND
  R5: Manufacturer Part Number: RR0816P-102-D; Supplier Part Number 1: RR08P1.0KDDKR-ND
R2-R4 = Res3: as R33 on sheet Analog; Supplier 1: Digi-Key
  R2: Manufacturer Part Number: ERA-3AEB2492V; Supplier Part Number 1: P24.9KDBCT-ND
  R3 R4: Manufacturer Part Number: ERA-3AEB393V; Supplier Part Number 1: P39KDBCT-ND
TP4 = 402046: as TP5 on sheet Analog; Supplier 1: Digi-Key; Supplier Part Number 1: 36-5003-ND
U1 = TL072CD: IC OPAMP JFET 4MHZ 8SO; Manufacturer: STMicroelectronics; Manufacturer Part Number: TL072CDT; Supplier 1: Digi-Key; Supplier Part Number 1: 497-2200-1-ND

## Nets that join several sheets
+2.5VREF: Analog (R29.1 R37.3 R38.3), Processor (C24.2 U6.2), Power Supplies (C7.2 TP2.1 U3.5)
+3.3V: U_Encoders_X (R6X.2 R7X.1), U_Encoders_Y (R6Y.2 R7Y.1), Analog (5 pins), Communications (S3.3), Processor (22 pins), Power Supplies (9 pins)
GND: U_Encoders_X (C5X.1 C6X.1 U2_EX.2 U2_EX.4), U_Encoders_Y (C5Y.1 C6Y.1 U2_EY.2 U2_EY.4), Analog (16 pins), Communications (14 pins), Processor (33 pins), Power Supplies (21 pins), Audio (5 pins)
VCC: Analog (R33.2 R36.2), Power Supplies (6 pins), Audio (C54.2 U1.8)
VEE: Power Supplies (C9.2 D2.1), Audio (C55.2 U1.4)
NetC5X_2: U_Encoders_X (C5X.2 R8X.2), Processor (U5.4)
NetC5Y_2: U_Encoders_Y (C5Y.2 R8Y.2), Processor (U5.30)
NetC6X_2: U_Encoders_X (C6X.2 R9X.2), Processor (U5.3)
NetC6Y_2: U_Encoders_Y (C6Y.2 R9Y.2), Processor (U5.29)
NetC40_2: Analog (C40.2 R37.2 TP8.1), Processor (R18.2)
NetC42_2: Analog (C42.2 R38.2 TP11.1), Processor (R19.2)
NetR3_2: Processor (R20.1 R21.1), Audio (R3.2)
NetR13_2: Analog (R31.1 TP6.1 U9.1), Processor (R13.2)
NetR14_2: Analog (R34.1 TP7.1 U9.7), Processor (R14.2)
NetR15_2: Analog (TP10.1 U10.1 U10.2), Processor (R15.2)
NetR41_2: Communications (R41.2), Processor (U5.44)
NetR42_2: Communications (R42.2), Processor (U5.45)
NetR44_2: Communications (R44.2 R45.1 TP20.1), Processor (U5.42)
NetR46_1: Communications (R46.1), Processor (U5.60)
NetU2_EX_1: U_Encoders_X (U2_EX.1), Processor (U5.2)
NetU2_EY_1: U_Encoders_Y (U2_EY.1), Processor (U5.27)